# EAGLE design merlinadapt (EAGLE 5.10)
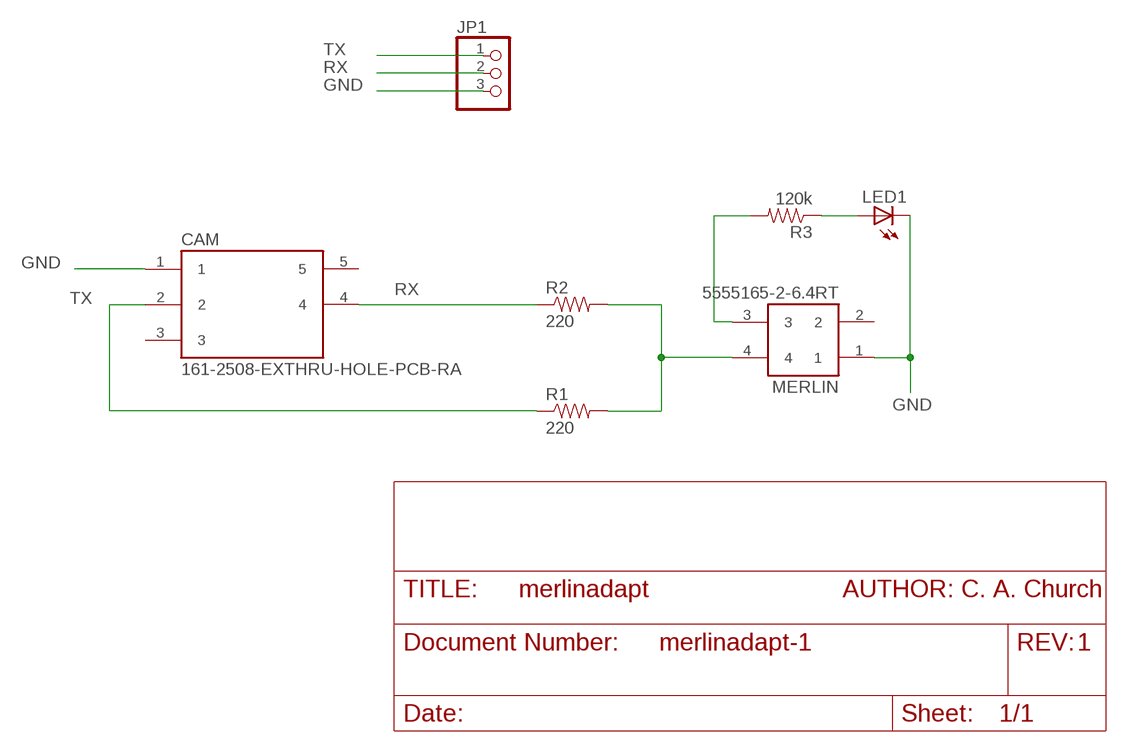
[diagram p0: schematic, sheet 1]

## Parts
CAM  161-2508-EXTHRU-HOLE-PCB-RA  [PCB-HORIZ]
JP1  PINHD-1X3  [1X03]
LED1  LEDCHIP-LED0603  [CHIP-LED0603]
MERLIN  5555165-2-6.4RT  [CONNMODJACK]
R1  220  RESISTOR0402-RES  [0402-RES]
R2  220  RESISTOR0402-RES  [0402-RES]
R3  120k  RESISTOR0402-RES  [0402-RES]

## Nets
COM: MERLIN.4 R1.2 R2.2
GND: CAM.1 JP1.3 LED1.C MERLIN.1
N$2: LED1.A R3.1
RX: CAM.4 JP1.2 R2.1
TX: CAM.2 JP1.1 R1.1
VCC: MERLIN.3 R3.2
Unconnected: CAM.3 CAM.5 MERLIN.2

## Notes on the sheet
- AUTHOR: C. A. Church
- merlinadapt-1 | 1

## Library data of the parts
CAM = kobiconn-161-2508-ex:161-2508-EX
JP1 = pinhead:PINHD-1X3: PIN HEADER
LED1 = led:LED: LED OSRAM: - CHIPLED LG R971, LG N971, LY N971, LG Q971, LY Q971, LO R971, LY R971 LH N974, LH R974 LS Q976, LO Q976, LY Q976 LO Q996 - Hyper CHIPLED LW Q18S LB Q993, LB Q99A, LB R99A - SideLED LS A670, LO A670, LY A670, LG A670, LP A670 LB A673, LV A673, LT A673, LW A673 LH A674 LY A675 LS A676, LA A676, LO A676, LY A676, LW A676 LS A679, LY A679, LG A679 - Hyper Micro SIDELED® LS Y876, LA Y876, LO Y876, LY Y876 LT Y87S - SmartLED LW L88C, LW L88S LB L89C, LB L89S, LG L890 LS L89K, LO L89K, LY L89K LS L896, LA L896, LO L896, LY L896 - TOPLED LS T670, LO T670, LY T670, LG T670, LP T670 LSG T670, LSP T670, LSY T670, LOP T670, LYG T670 LG T671, LOG T671, LSG T671 LB T673, LV T673, LT T673, LW T673 LH T674 LS T676, LA T676, LO T676, LY T676, LB T676, LH T676, LSB T676, LW T676 LB T67C, LV T67C, LT T67C, LS T67K, LO T67K, LY T67K, LW E67C LS E67B, LA E67B, LO E67B, LY E67B, LB E67C, LV E67C, LT E67C LW T67C LS T679, LY T679, LG T679 LS T770, LO T770, LY T770, LG T770, LP T770 LB T773, LV T773, LT T773, LW T773 LH T774 LS E675, LA E675, LY E675, LS T675 LS T776, LA T776, LO T776, LY T776, LB T776 LHGB T686 LT T68C, LB T68C - Hyper Mini TOPLED® LB M676 - Mini TOPLED Santana® LG M470 LS M47K, LO M47K, LY M47K Source: http://www.osram.convergy.de LUXEON: - LUMILED® LXK2-PW12-R00, LXK2-PW12-S00, LXK2-PW14-U00, LXK2-PW14-V00 LXK2-PM12-R00, LXK2-PM12-S00, LXK2-PM14-U00 LXK2-PE12-Q00, LXK2-PE12-R00, LXK2-PE12-S00, LXK2-PE14-T00, LXK2-PE14-U00 LXK2-PB12-K00, LXK2-PB12-L00, LXK2-PB12-M00, LXK2-PB14-N00, LXK2-PB14-P00, LXK2-PB14-Q00 LXK2-PR12-L00, LXK2-PR12-M00, LXK2-PR14-Q00, LXK2-PR14-R00 LXK2-PD12-Q00, LXK2-PD12-R00, LXK2-PD12-S00 LXK2-PH12-R00, LXK2-PH12-S00 LXK2-PL12-P00, LXK2-PL12-Q00, LXK2-PL12-R00 Source: www.luxeon.com KINGBRIGHT: KA-3528ASYC Source: www.kingbright.com
MERLIN = TE-phone-jacks:5555165-2-6.4RT: CONN MOD JACK 6-4 RT/A PCB 50AU
R1-R3 = SparkFun:RESISTOR: Resistor Basic schematic elements and footprints for 0603, 1206, and PTH 1/10th watt (small) resistors.

## Board
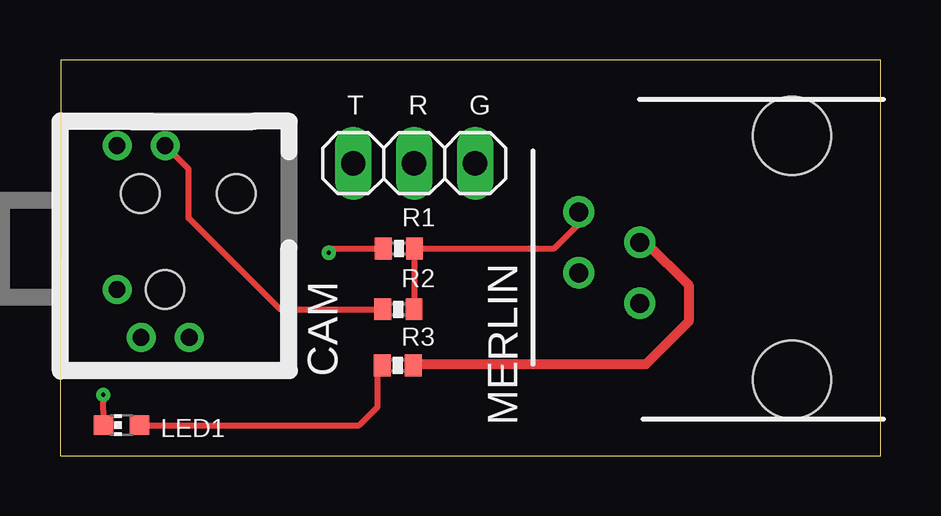
[diagram p1: board, top side]
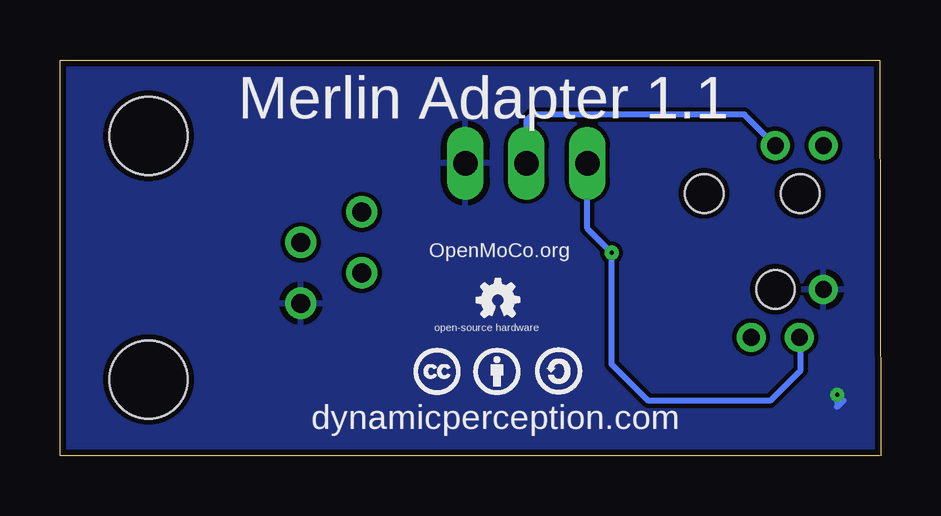
[diagram p2: board, bottom side, seen from below]

Size 34.19 x 16.5 mm. Coordinates in mm from the lower left corner, seen from the top.
Outline: 0.03,0 34.19,0 34.19,16.5 0.03,16.5 0,0
Copper layers (1*16): Top 0.035mm / dielectric 1.5mm / Bottom 0.035mm
Design rules: minimum track width 7mil, minimum drill 7mil, track to track 7mil, track to pad 7mil, pad to pad 7mil, via to via 7mil, smd to smd 7mil, copper to edge 10mil, drill to drill 7mil, minimum pad ring 10mil, minimum via ring 8mil, stop-mask expansion 4mil, vias tented up to drill 0mil, thermal gap 10mil

### Footprints (pad centres in the part's own frame; a part is rotated, then mirrored left to right if it is on the bottom)
PCB-HORIZ = drill 0.7: 1 -1.96,-0.32; 2 -3.96,-1.32; 3 -3.96,-3.33; 4 4.04,-2.32; 5 4.04,-0.32 | hole 1.6: 2.04,-1.29; 2.04,-5.29; -1.96,-2.32
1X03 = drill 1.016 long: 1 -2.54,0; 2 0,0; 3 2.54,0
CHIP-LED0603 = smd 0.8 x 0.8: A 0,-0.75; C 0,0.75
CONNMODJACK = drill 0.8: 1 -1.27,3.81; 2 0,6.35; 3 1.27,3.81; 4 2.54,6.35 | hole 3.251: -4.445,-2.54; 5.715,-2.54
0402-RES = smd 0.7 x 0.9: 1 -0.65,0; 2 0.65,0

### Placement (x,y rotation side)
CAM  2.06,8.89 90 top
JP1  14.76,12.19 0 top
LED1  2.57,1.27 90 top
MERLIN  27.97,7.62 90 top
R1  14.12,8.64 0 top
R2  14.1,6.1 0 top
R3  14.07,3.76 0 top

### Tracks (layer width: path | path; a pad name or v marks a point on that pad's centre or on a via)
COM
  Top 0.254: MERLIN.4 21.62,9.65 20.6,8.64 R1.2 14.77,6.12 R2.2
GND  (via drill 0.18)
  Top 0.254: LED1.C v1.8,2.54
  Bottom 0.254: v1.8,2.54 1.8,2.03 1.55,2.29
  pour Bottom: 0.03,16.51 34.01,16.51 34.01,0 -0.03,0.03
N$2
  Top 0.254: LED1.A 12.47,1.27 13.23,2.03 13.23,3.57 R3.1
RX
  Top 0.254: 4.4,12.95 CAM.4 5.36,11.95 5.36,9.91 9.17,6.1 R2.1
  Bottom 0.254: JP1.2 14.76,13.97 14.5,14.22 5.67,14.22 CAM.4
TX  (via drill 0.18)
  Top 0.254: R1.1 11.2,8.64 v11.2,8.46
  Bottom 0.254: CAM.2 3.33,4.88 3.33,3.56 4.6,2.29 9.68,2.29 11.2,3.81 v11.2,8.46 12.22,9.47 JP1.1
VCC
  Top 0.406: MERLIN.3 24.41,8.89 26.19,7.11 26.19,5.59 24.41,3.81 14.77,3.81 R3.2

### Text on the board
tNames: T | R | G | R3
bNames: Merlin Adapter 1.1 | OpenMoCo.org | open-source hardware | dynamicperception.com
200bmp: F:/OSHWv1.bmp